# EAGLE design EmonTx_v2.2 (EAGLE 5.11)
ABBREV: tx1; DRAWING_AUTHOR: Glyn Husdson; PROJECT: EmonTx V1.0
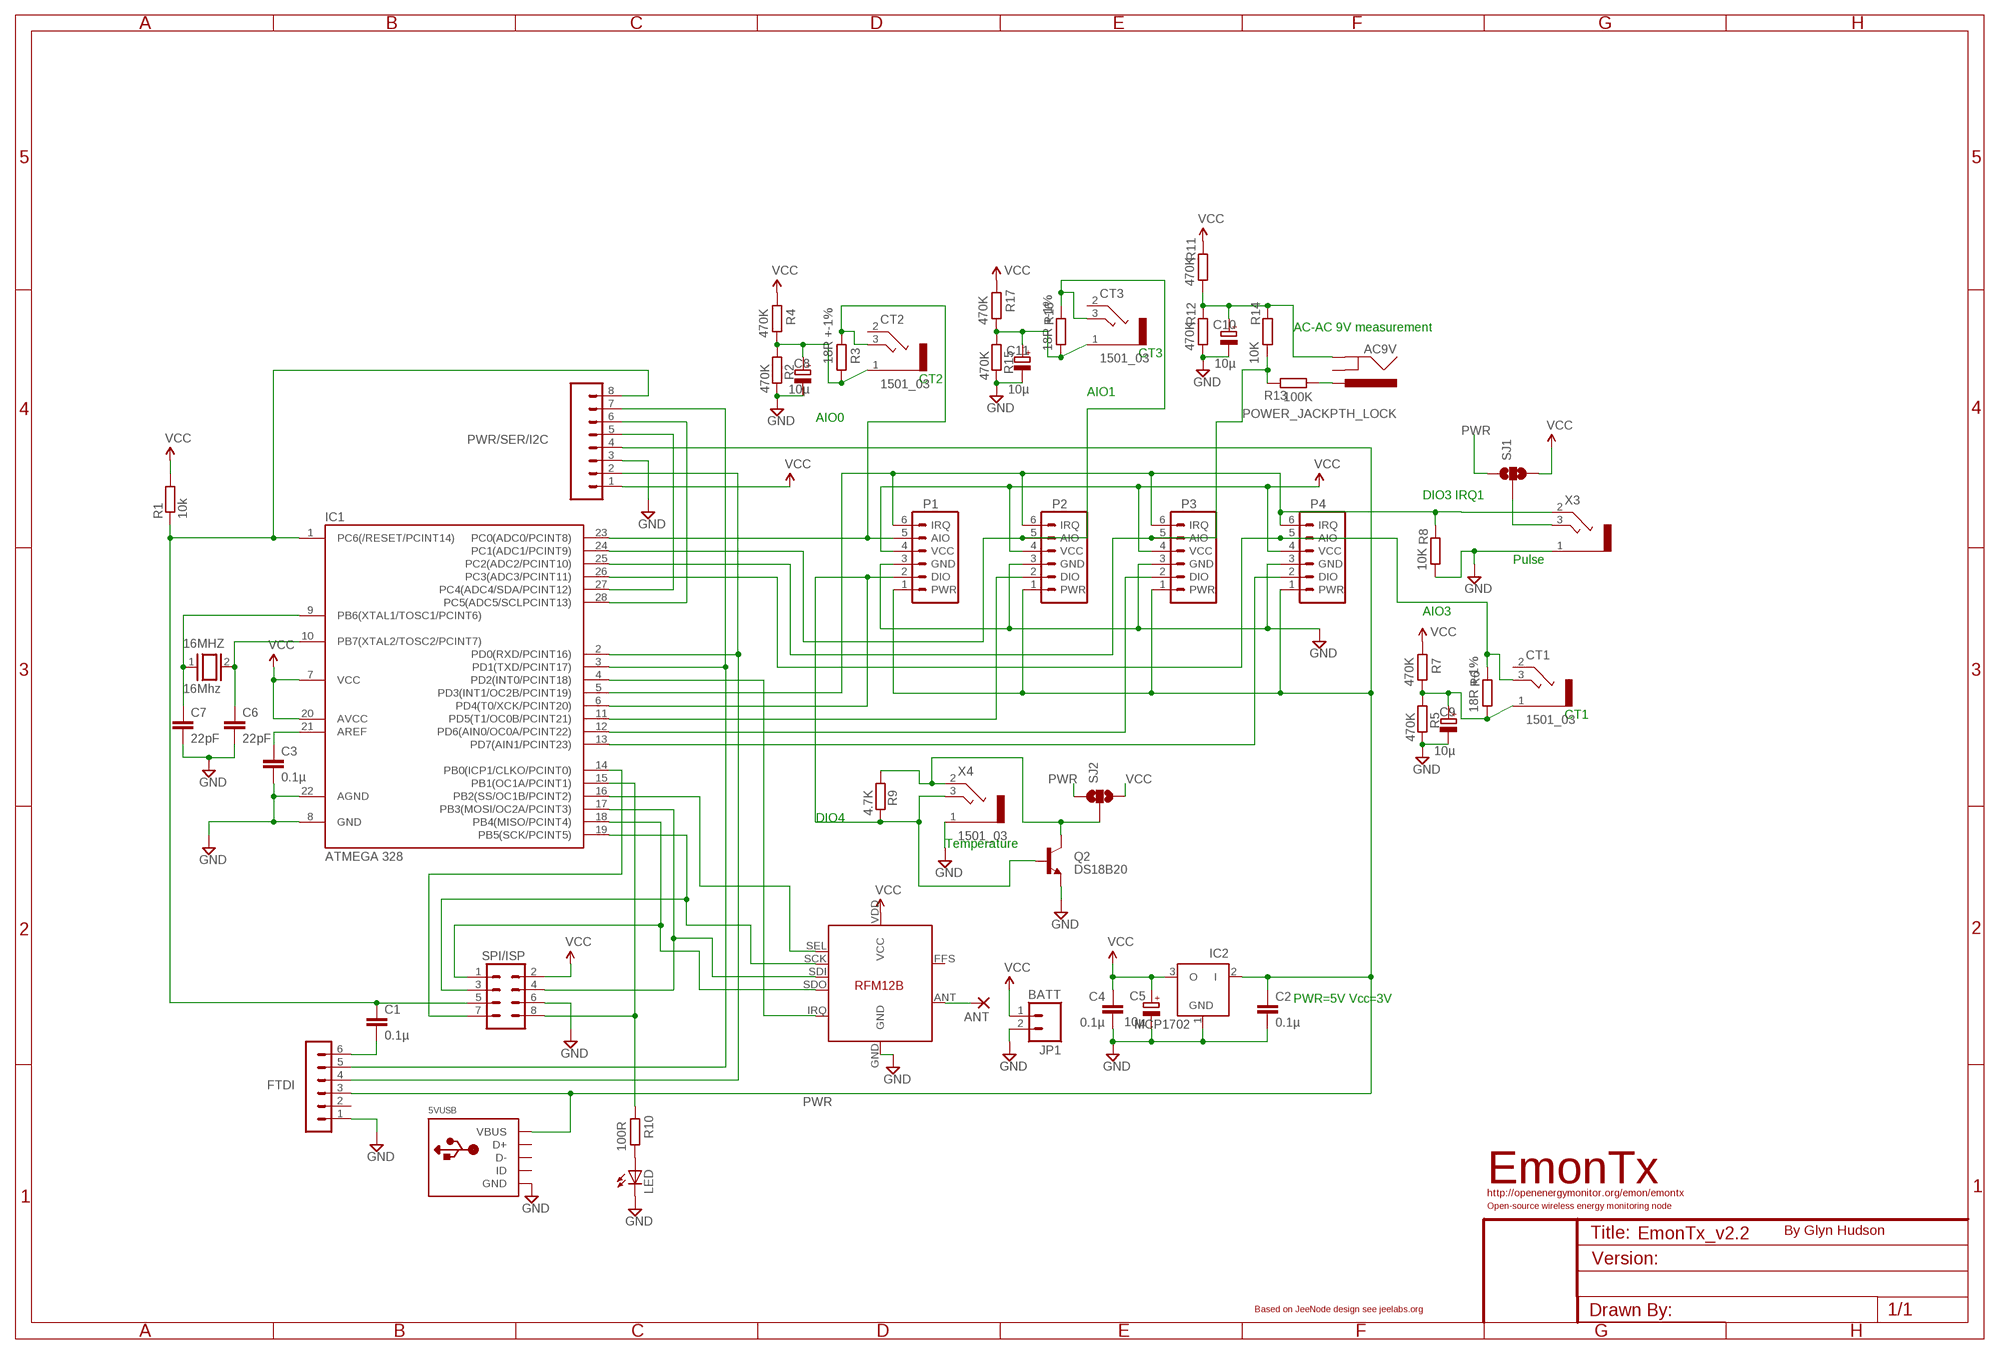
[diagram p0: schematic, sheet 1]

## Parts
5VUSB  USBMOLEX  [USB-MINIB-THM-MOLEX]
16MHZ  16Mhz  XTAL/S  [QS]
AC9V  POWER_JACKPTH_LOCK  [POWER_JACK_PTH_LOCK]
ANT  1,6/0,8  [1,6/0,8]
C1  0.1µ  C-EU025-024X044  [C025-024X044]
C2  0.1µ  C-EU025-024X044  [C025-024X044]
C3  0.1µ  C-EU025-024X044  [C025-024X044]
C4  0.1µ  C-EU025-024X044  [C025-024X044]
C5  10µ  CPOL-EUE1.8-4  [E1,8-4]
C6  22pF  C2.5/2  [C2.5-2]
C7  22pF  C2.5/2  [C2.5-2]
C8  10µ  CPOL-EUE1.8-4  [E1,8-4]
C9  10µ  CPOL-EUE1.8-4  [E1,8-4]
C10  10µ  CPOL-EUE1.8-4  [E1,8-4]
C11  10µ  CPOL-EUE1.8-4  [E1,8-4]
CT1  1501_03  [20-0144]
CT2  1501_03  [20-0144]
CT3  1501_03  [20-0144]
FTDI  FTDI  MA06-1  [MA06-1]
IC1  ATMEGA 328  ATMEGA48/88/168-PU  [DIL28-3]
IC2  MCP1702  MCP1702Z  [TO92]
JP1  BATT  M02LOCK_LONGPADS  [1X02_LOCK_LONGPADS]
LED  LED3MM  [LED3MM]
P1  JEEPORT  JEEPORT-LONGPADS  [PORT6PIN]
P2  JEEPORT  JEEPORT-LONGPADS  [PORT6PIN]
P3  JEEPORT  JEEPORT-LONGPADS  [PORT6PIN]
P4  JEEPORT  JEEPORT-LONGPADS  [PORT6PIN]
PWR/SER/I2C  M08  [1X08]
Q2  DS18B20  TRANSISTOR_NPNTO92  [TO-92]
R1  10k  R-EU_0204/7  [0204/7]
R2  470K  R-EU_0204/7  [0204/7]
R3  18R +-1%  R-EU_0204/7  [0204/7]
R4  470K  R-EU_0204/7  [0204/7]
R5  470K  R-EU_0204/7  [0204/7]
R6  18R +-1%  R-EU_0204/7  [0204/7]
R7  470K  R-EU_0204/7  [0204/7]
R8  10K  R-EU_0204/7  [0204/7]
R9  4.7K  R-EU_0204/7  [0204/7]
R10  100R  R-EU_0204/7  [0204/7]
R11  470K  R-EU_0204/7  [0204/7]
R12  470K  R-EU_0204/7  [0204/7]
R13  100K  R-EU_0204/7  [0204/7]
R14  10K  R-EU_0204/7  [0204/7]
R15  470K  R-EU_0204/7  [0204/7]
R16  18R +-1%  R-EU_0204/7  [0204/7]
R17  470K  R-EU_0204/7  [0204/7]
SJ1  SOLDERJUMPER_2WAY-OLDS  [SJ_3]
SJ2  SOLDERJUMPER_2WAY-OLDS  [SJ_3]
SV7  SPI/ISP  MA04-2  [MA04-2]
U$1  RFM12B  [RFM12B]
X3  1501_03  [20-0144]
X4  1501_03  [20-0144]

## Nets
A1: CT3.3 IC1.24(PC1(ADC1/PCINT9)) P2.5(AIO) R16.2
A2: IC1.25(PC2(ADC2/PCINT10)) P3.5(AIO) R13.2 R14.1
A3: CT1.3 IC1.26(PC3(ADC3/PCINT11)) P4.5(AIO) R6.2
GND [power]: 5VUSB.GND C2.2 C3.2 C4.2 C5.- C6.2 C7.2 C8.- C9.- C10.- C11.- FTDI.1 IC1.8(GND) IC1.22(AGND) IC2.1(GND) JP1.2 LED.K(C) P1.3(GND) P2.3(GND) P3.3(GND) P4.3(GND) PWR/SER/I2C.3 Q2.1(E) R2.2 R5.2 R8.1 R12.1 R15.2 SV7.6 U$1.GND X3.1 X4.1
INT2: IC1.5(PD3(INT1/OC2B/PCINT19)) P1.6(IRQ) P2.6(IRQ) P3.6(IRQ) P4.6(IRQ) R8.2 X3.2
N$1: 16MHZ.2 C6.1 IC1.10(PB7(XTAL2/TOSC2/PCINT7))
N$2: IC1.18(PB4(MISO/PCINT4)) SV7.1 U$1.SDO
N$3: IC1.17(PB3(MOSI/OC2A/PCINT3)) SV7.4 U$1.SDI
N$4: CT2.3 IC1.23(PC0(ADC0/PCINT8)) P1.5(AIO) R3.2
N$5: IC1.19(PB5(SCK/PCINT5)) SV7.3 U$1.SCK
N$6: IC1.15(PB1(OC1A/PCINT1)) R10.2 SV7.8
N$7: IC1.4(PD2(INT0/PCINT18)) U$1.IRQ
N$8: LED.A R10.1
N$9: IC1.11(PD5(T1/OC0B/PCINT21)) P2.2(DIO)
N$10: IC1.12(PD6(AIN0/OC0A/PCINT22)) P3.2(DIO)
N$11: IC1.13(PD7(AIN1/PCINT23)) P4.2(DIO)
N$12: 16MHZ.1 C7.1 IC1.9(PB6(XTAL1/TOSC1/PCINT6))
N$13: ANT.1(P) U$1.ANT
N$14: SJ1.2 X3.3
N$15: C1.2 FTDI.6
N$16: AC9V.GND C10.+ R11.1 R12.2 R14.2
N$17: C9.+ CT1.1 R5.1 R6.1 R7.1
N$18: IC1.16(PB2(SS/OC1B/PCINT2)) U$1.SEL
N$19: C3.1 IC1.21(AREF)
N$20: C8.+ CT2.1 R2.1 R3.1 R4.1
N$21: AC9V.PWR R13.1
N$22: IC1.14(PB0(ICP1/CLKO/PCINT0)) SV7.7
N$23: C11.+ CT3.1 R15.1 R16.1 R17.1
N$24: IC1.28(PC5(ADC5/SCLPCINT13)) PWR/SER/I2C.6
N$25: IC1.27(PC4(ADC4/SDA/PCINT12)) PWR/SER/I2C.5
N$26 [power]: IC1.6(PD4(T0/XCK/PCINT20)) P1.2(DIO) Q2.2(B) R9.2 X4.3
PWR [power]: 5VUSB.VBUS C2.1 FTDI.3 IC2.2(I) P1.1(PWR) P2.1(PWR) P3.1(PWR) P4.1(PWR) PWR/SER/I2C.4 Q2.3(C) R9.1 SJ1.1 SJ2.1 SJ2.2 X4.2
RST: C1.1 IC1.1(PC6(/RESET/PCINT14)) PWR/SER/I2C.8 R1.1 SV7.5
RXD: FTDI.4 IC1.2(PD0(RXD/PCINT16)) PWR/SER/I2C.2
TXD: FTDI.5 IC1.3(PD1(TXD/PCINT17)) PWR/SER/I2C.7
VCC [power]: C4.1 C5.+ IC1.7(VCC) IC1.20(AVCC) IC2.3(O) JP1.1 P1.4(VCC) P2.4(VCC) P3.4(VCC) P4.4(VCC) PWR/SER/I2C.1 R1.2 R4.2 R7.2 R11.2 R17.2 SJ1.3 SJ2.3 SV7.2 U$1.VDD(VCC)
Unconnected: 5VUSB.D+ 5VUSB.D- 5VUSB.ID AC9V.GNDBREAK CT1.2 CT2.2 CT3.2 FTDI.2 U$1.FFS

## Notes on the sheet
- AC-AC 9V measurement
- CT3
- CT2
- AIO1
- AIO0
- DIO3 IRQ1
- Pulse
- AIO3
- CT1
- DIO4
- Temperature
- PWR=5V Vcc=3V
- EmonTx
- http://openenergymonitor.org/emon/emontx
- Open-source wireless energy monitoring node
- By Glyn Hudson
- Based on JeeNode design see jeelabs.org

## Library data of the parts
5VUSB = adafruit:USB: USB Connectors USBMINIB - Surface Mount Female Mini-B USB Connector 4UConnector: 06564 By microbuilder.eu Thru-hole RA Female Mini-B USB Connector 4UConnector: 18732 By ladyada.net
16MHZ = special:XTAL/S: CRYSTAL
AC9V = SparkFun:POWER_JACK: Power Jack This is the standard 5.5mm barrel jack for power. The PTH is the most common, proven, reliable, footprint. All others are experimental. The Slot footprint only works if the mill layer is transmitted to the PCB fab house so be warned. Spark Fun Electronics SKU : PRT-00119. Mating wall wart : TOL-00298 (and others)
ANT = JeeLabs:1,6/0,8: THROUGH-HOLE PAD
C1-C4 = resistor:C-EU: CAPACITOR, European symbol
C5 C8-C11 = resistor:CPOL-EU: POLARIZED CAPACITOR, European symbol
C6 C7 = capacitor-wima:C: CAPACITOR naming: grid - package width
CT1-CT3 X3 X4 = rapid_3.5mm_jack:1501_03: Truconnect Minature PCB jack socket 3.5mm Rapid Part: 20-0144 Source: http://www.rapidonline.com/netalogue/specs/20-0144.pdff; OC_NEWARK: unknown; RAPID: 20-0144
FTDI = JeeLabs:MA06-1: PIN HEADER
IC1 = atmega8:ATMEGA48/88/168-PU
IC2 = JeeLabs:MCP1702: 200 mA, Low Power Low Dropout Voltage Regulator
JP1 = SparkFun:M02: Header 2 Standard 2-pin 0.1" header. Use with straight break away headers (SKU : PRT-00116), right angle break away headers (PRT-00553), swiss pins (PRT-00743), machine pins (PRT-00117), and female headers (PRT-00115). Molex polarized connector foot print use with SKU : PRT-08233 with associated crimp pins and housings.
LED = adafruit:LED: LED OSRAM: - CHIPLED LG R971, LG N971, LY N971, LG Q971, LY Q971, LO R971, LY R971 LH N974, LH R974 LS Q976, LO Q976, LY Q976 LO Q996 - Hyper CHIPLED LW Q18S LB Q993, LB Q99A, LB R99A - SideLED LS A670, LO A670, LY A670, LG A670, LP A670 LB A673, LV A673, LT A673, LW A673 LH A674 LY A675 LS A676, LA A676, LO A676, LY A676, LW A676 LS A679, LY A679, LG A679 - Hyper Micro SIDELED® LS Y876, LA Y876, LO Y876, LY Y876 LT Y87S - SmartLED LW L88C, LW L88S LB L89C, LB L89S, LG L890 LS L89K, LO L89K, LY L89K LS L896, LA L896, LO L896, LY L896 - TOPLED LS T670, LO T670, LY T670, LG T670, LP T670 LSG T670, LSP T670, LSY T670, LOP T670, LYG T670 LG T671, LOG T671, LSG T671 LB T673, LV T673, LT T673, LW T673 LH T674 LS T676, LA T676, LO T676, LY T676, LB T676, LH T676, LSB T676, LW T676 LB T67C, LV T67C, LT T67C, LS T67K, LO T67K, LY T67K, LW E67C LS E67B, LA E67B, LO E67B, LY E67B, LB E67C, LV E67C, LT E67C LW T67C LS T679, LY T679, LG T679 LS T770, LO T770, LY T770, LG T770, LP T770 LB T773, LV T773, LT T773, LW T773 LH T774 LS E675, LA E675, LY E675, LS T675 LS T776, LA T776, LO T776, LY T776, LB T776 LHGB T686 LT T68C, LB T68C - Hyper Mini TOPLED® LB M676 - Mini TOPLED Santana® LG M470 LS M47K, LO M47K, LY M47K Source: http://www.osram.convergy.de/
P1-P4 = JeeParts:JEEPORT: PIN HEADER
PWR/SER/I2C = SparkFun:M08: Header 8 Standard 8-pin 0.1" header. Use with straight break away headers (SKU : PRT-00116), right angle break away headers (PRT-00553), swiss pins (PRT-00743), machine pins (PRT-00117), and female headers (PRT-00115).
Q2 = SparkFun:TRANSISTOR_NPN: Transistor NPN BJT configuration in SOT23 package. MMBT2222 is the common NPN we use. Double check BCE configuration again layout.
R1 = resistor:R-EU_: RESISTOR, European symbol
R2-R17 = rcl:R-EU_: RESISTOR, European symbol
SJ1 SJ2 = SparkFun:SOLDERJUMPER_2WAY-OLD: Solder Jumper 2 way solder jumper
SV7 = JeeLabs:MA04-2: PIN HEADER
U$1 = JeeLabs:RFM12B

## Net classes
0 default: width 0.203 mm, drill 0.6 mm, clearance 0.203 mm
1 power: width 0.381 mm, drill 0.6 mm, clearance 0.254 mm

## Board
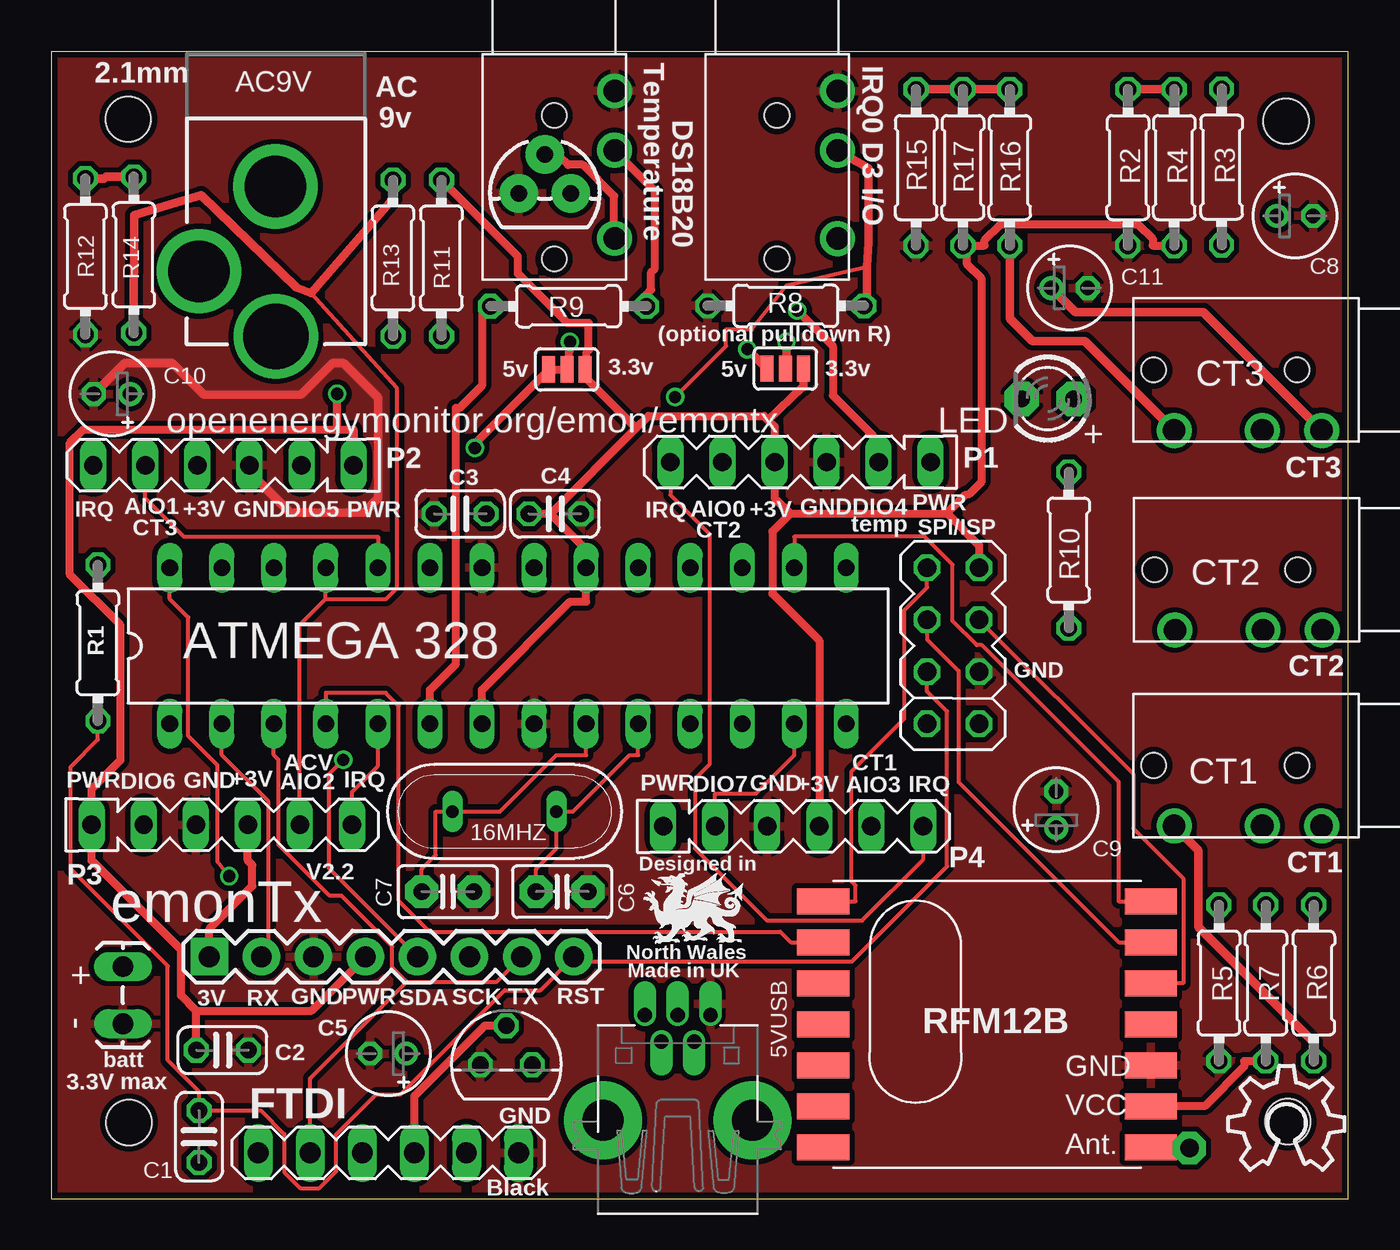
[diagram p1: board, top side]
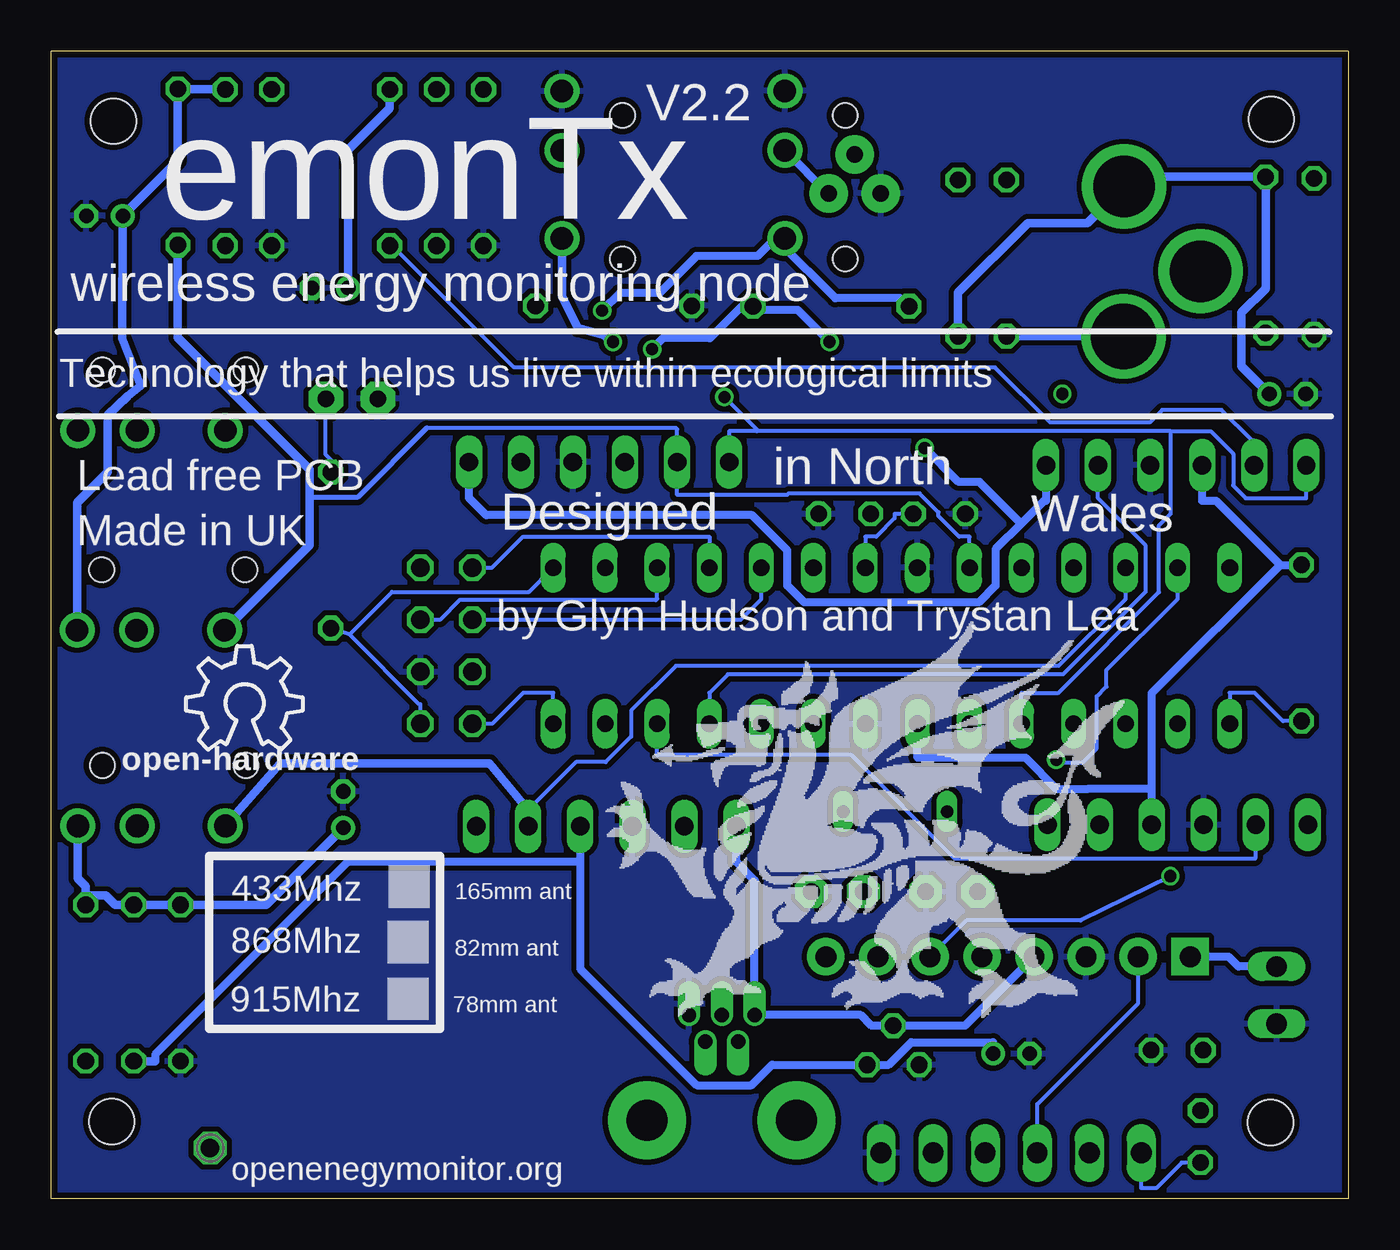
[diagram p2: board, bottom side, seen from below]

Size 63.3 x 56 mm. Coordinates in mm from the lower left corner, seen from the top.
Outline: 0,56 63.3,56 63.3,0 0,0 0,56
Copper layers (1*16): Top 0.035mm / dielectric 1.5mm / Bottom 0.035mm
Design rules "PCB-POOL Standard *": minimum track width 0.2mm, minimum drill 0.6mm, track to track 0.2mm, track to pad 0.2mm, pad to pad 0.2mm, via to via 0.2mm, smd to smd 0.2mm, copper to edge 0.3mm, drill to drill 0.2mm, minimum pad ring 0.2mm, minimum via ring 0.15mm, stop-mask expansion 0.075mm, vias tented up to drill 0.6mm, thermal gap 0.2mm
Holes 2.2 mm at 3.76,52.69 60.26,52.59 60.34,3.76 3.79,3.71

### Footprints (pad centres in the part's own frame; a part is rotated, then mirrored left to right if it is on the bottom)
USB-MINIB-THM-MOLEX = drill 0.7 offset: D+ 0,9.72; D- -0.8,8.42; GND 1.6,9.72; ID 0.8,8.42; VBUS -1.6,9.72 | drill 2 pad 3.81 round: GND1 -3.65,4.57; GND4 3.65,4.57
QS = drill 0.61 long: 1 -2.54,0; 2 2.54,0
POWER_JACK_PTH_LOCK = drill 2.997 pad 4.115 round: GND 0.025,6.557; GNDBREAK 3.762,10.7 | drill 3.2 pad 4.115 round: PWR 0,13.878
1,6/0,8 = drill 0.9 pad 1.6 octagon: 1 0,0
C025-024X044 = drill 0.813 octagon: 1 -1.27,0; 2 1.27,0
E1,8-4 = drill 0.711 pad 1.168 round: + -0.889,0 | drill 0.711 pad 1.168 octagon: - 0.889,0
C2.5-2 = drill 0.813 pad 1.6 octagon: 1 -1.27,0; 2 1.27,0
20-0144 = drill 1.1 pad 1.7 round: 1 3.45,0.2; 2 3.45,-2.7; 3 3.45,-7 | hole 1.2: 0.5,-1; 0.5,-8
MA06-1 = drill 1.016 long: 1 0,0; 2 2.54,0; 3 5.08,0; 4 7.62,0; 5 10.16,0; 6 12.7,0
DIL28-3 = drill 0.813 long: 1 -16.51,-3.81; 2 -13.97,-3.81; 3 -11.43,-3.81; 4 -8.89,-3.81; 5 -6.35,-3.81; 6 -3.81,-3.81; 7 -1.27,-3.81; 8 1.27,-3.81; 9 3.81,-3.81; 10 6.35,-3.81; 11 8.89,-3.81; 12 11.43,-3.81; 13 13.97,-3.81; 14 16.51,-3.81; 15 16.51,3.81; 16 13.97,3.81; 17 11.43,3.81; 18 8.89,3.81; 19 6.35,3.81; 20 3.81,3.81; 21 1.27,3.81; 22 -1.27,3.81; 23 -3.81,3.81; 24 -6.35,3.81; 25 -8.89,3.81; 26 -11.43,3.81; 27 -13.97,3.81; 28 -16.51,3.81
TO92 = drill 0.813 octagon: 1 -1.27,0; 2 0,1.905; 3 1.27,0
1X02_LOCK_LONGPADS = drill 1.016 long: 1 -0.127,0; 2 2.667,0
LED3MM = drill 0.813 pad 1.676 octagon: A -1.27,0; K 1.27,0
PORT6PIN = drill 0.9 long: 1 -6.35,0; 2 -3.81,0; 3 -1.27,0; 4 1.27,0; 5 3.81,0; 6 6.35,0
1X08 = drill 1.016 pad 1.829 square: 1 0,0 | drill 1.016 pad 1.829 round: 2 2.54,0; 3 5.08,0; 4 7.62,0; 5 10.16,0; 6 12.7,0; 7 15.24,0; 8 17.78,0
TO-92 = drill 0.813 pad 1.88 round: 1 -1.27,0; 2 0,1.905; 3 1.27,0
0204/7 = drill 0.813 octagon: 1 -3.81,0; 2 3.81,0
SJ_3 = smd 0.635 x 1.27: 1 -0.889,0; 2 0,0; 3 0.889,0
MA04-2 = drill 0.9 octagon: 1 -3.81,-1.27; 2 -3.81,1.27; 3 -1.27,-1.27; 4 -1.27,1.27; 5 1.27,-1.27; 6 1.27,1.27; 7 3.81,-1.27; 8 3.81,1.27
RFM12B = smd 2.54 x 1.27: ANT 8,-6; FFS -8,2; GND 8,-2; IRQ -8,4; P$8 -8,0; P$9 -8,-2; P$10 -8,-4; P$12 -8,-6; P$16 8,0; SCK 8,4; SDI 8,2; SDO -8,6; SEL 8,6; VDD 8,-4

### Placement (x,y rotation side)
5VUSB  30.57,-0.75 0 top
16MHZ  22.12,18.9 0 top
AC9V  10.97,55.96 180 top
ANT  55.54,2.47 0 bottom
C1  7.21,3.03 270 top
C2  8.35,7.25 0 top
C3  19.96,33.42 180 top
C4  24.58,33.42 0 top
C5  16.44,7.08 180 top
C6  24.93,14.99 0 top
C7  19.35,14.98 0 top
C8  60.7,47.96 0 top
C9  49.05,18.99 90 top
C10  2.96,39.28 180 top
C11  49.7,44.45 0 top
CT1  61.8,21.64 270 top
CT2  61.84,31.2 270 top
CT3  61.8,40.94 270 top
FTDI  22.8,2.24 180 top
IC1  22.29,26.98 0 top
IC2  22.21,6.53 0 top
JP1  3.5,11.2 270 top
LED  48.63,39.04 180 top
P1  36.57,35.95 180 top
P2  8.4,35.8 180 top
P3  8.32,18.24 0 top
P4  36.21,18.17 0 top
PWR/SER/I2C  7.72,11.8 0 top
Q2  24.09,49.07 0 top
R1  2.28,27.12 90 top
R2  52.55,50.32 270 top
R3  57.12,50.35 270 top
R4  54.81,50.32 270 top
R5  56.99,10.52 270 top
R6  61.61,10.52 270 top
R7  59.28,10.52 270 top
R8  35.85,43.57 0 top
R9  25.25,43.55 180 top
R10  49.66,31.65 270 top
R11  19.04,45.91 90 top
R12  1.67,45.98 90 top
R13  16.68,45.91 90 top
R14  4.03,46.06 90 top
R15  42.21,50.32 270 top
R16  46.78,50.32 270 top
R17  44.49,50.32 270 top
SJ1  35.83,40.52 0 top
SJ2  25.16,40.47 0 top
SV7  44.01,26.98 270 top
U$1  45.67,8.51 0 top
U$2  Open-source Hardware  [OSHW_8X200_NOTEXT]  56.7,21.9 0 bottom
U$3  Open-source Hardware  [OSHW_8X200_NOTEXT]  57.45,1.4 0 top
X3  34.92,53.86 0 top
X4  24.05,53.86 0 top

### Tracks (layer width: path | path; a pad name or v marks a point on that pad's centre or on a via)
A1
  Top 0.203: IC1.24 15.94,32.31 6.47,32.31 4.59,34.19 P2.5
  Top 0.406: R16.2 46.78,42.95 47.88,41.85 50.44,41.85 CT3.3
  Bottom 0.203: P2.5 4.59,36.99 4.69,36.99 6.19,38.49 9.09,38.49 9.7,37.88 14.55,37.88 17.24,40.57 40.71,40.57 46.65,46.51 R16.2
A2
  Top 0.203: 12.69,44.2 16.88,39.56 16.88,29.81 16.35,29.27 13.4,29.27 | 13.4,29.27 IC1.25 | P3.5 12.13,28 13.4,29.27
  Top 0.406: R14.1 4.05,48 7.33,48.98 11.98,44.45 12.69,44.2 16.68,48.8 R13.2
A3
  Top 0.203: CT1.3 54.81,18.17
  Top 0.406: R6.2 61.61,7.62 55.97,13.26 55.97,17 54.81,18.17
  Bottom 0.203: IC1.26 10.86,29.27 14.14,26 32.82,26 34.99,23.82 34.99,22.55 36.24,21.3 37.69,21.3 40.02,18.97
  Bottom 0.406: CT1.3 52.13,21.25 41.92,21.25 40.02,18.97 P4.5
GND
  Top 0.406: P2.3 9.67,35.48 11.66,33.49 15.26,33.49 15.95,34.18 15.95,39.09 14.27,40.78 13.73,40.78 12.19,39.25 7.44,39.25 5.9,40.78 3.58,40.78 C10.-
  pour Bottom (isolate 0.254): 65.61,58.79 65.75,-1.8 -1.62,-1.8 -1.48,58.79
  pour Top: -1.87,59.49 67.21,59.49 67.21,-2.56 -1.95,-2.56 -1.95,59.56
INT2  (via drill 0.6)
  Top 0.203: 39.81,43.72 R8.2 | P4.6 42.56,16.56 39.57,13.57 34.94,13.57 31.41,17.1 31.41,20.47 32.12,21.19 32.12,32.44 30.22,34.34 P1.6 | P3.6 14.67,19.85 15.94,21.12 IC1.5 | v30.45,39.12 32.94,41.61 32.94,42.43 34.21,42.43 35.9,44.58 39.8,45.49
  Top 0.406: X3.2 39.88,50.28 39.88,46.65 39.8,45.49 39.81,43.72
  Bottom 0.203: 8.66,37.45 28.87,37.45 | 28.87,37.45 30.22,37.45 P1.6 | 8.66,37.45 6.71,37.45 5.62,36.36 5.62,34.81 5.01,34.19 2.05,34.19 P2.6 | 8.66,37.45 8.66,33.43 9.24,32.86 9.24,29.6 14.15,24.69 15.94,24.69 IC1.5 | v30.45,39.12 28.87,37.55 28.87,37.45
N$1
  Top 0.203: IC1.10 28.64,21.65 28.22,21.65 25.47,18.9 16MHZ.2 24.66,17.08 23.66,16.09 C6.1
N$2
  Top 0.203: SV7.1 42.74,29.84 41.63,28.73 41.63,23.43 39.06,20.86 39.06,15.47 39.25,15.29 39.25,14.51 U$1.SDO
  Bottom 0.203: IC1.18 31.18,32.31 40.27,32.31 41.79,30.79 SV7.1
N$3
  Top 0.203: U$1.SDI 55.25,10.51 55.25,15.64 52.81,18.08 52.81,20.72 SV7.4
  Bottom 0.203: IC1.17 33.72,29.27 33.79,29.21 43.37,29.21 44.33,28.25 SV7.4
N$4
  Bottom 0.203: 44.97,37.62 32.82,37.62 32.76,37.55 P1.5 32.76,34.34 27.38,34.34 27.31,34.42 20.93,34.42 19.99,33.49 19.99,33.31 18.99,32.31 18.48,32.31 IC1.23
  Bottom 0.254: 50.68,34.23 48.36,34.23 44.97,37.62
  Bottom 0.406: R3.2 57.12,42.02 50.68,35.58 50.68,34.23 50.68,31.91 CT2.3
N$5
  Top 0.203: SV7.3 42.74,27.3 44.27,25.76 44.27,20.34 52.1,12.51 U$1.SCK
  Bottom 0.203: IC1.19 28.64,29.27 29.67,28.25 SV7.3
N$6
  Bottom 0.203: SV7.8 45.28,24.13 45.34,24.13 48.75,27.54 | 48.75,27.54 R10.2 | 48.75,27.54 46.67,29.61 39.98,29.61 IC1.15
N$7
  Top 0.203: IC1.4 13.4,24.69 16.33,24.69 16.96,24.06 16.96,14.53 18.47,13.02 35.59,13.02 36.1,12.51 U$1.IRQ
N$8
  Bottom 0.203: R10.1 49.66,36.07 49.9,36.31 LED.A
N$9
  Bottom 0.203: IC1.11 31.18,24.69 30.28,25.59 13.92,25.59 9.89,29.63 9.89,31.87 12.21,34.19 P2.2
N$10
  Bottom 0.203: IC1.12 33.72,21.65 24.26,21.65 19.19,16.59 4.56,16.59 4.51,16.64 P3.2
N$11
  Top 0.203: P4.2 32.4,19.77 34.38,19.77 36.26,21.65 IC1.13
N$12
  Top 0.203: C7.1 18.08,16.09 18.77,16.77 18.77,18.9 16MHZ.1 21.9,18.9 24.66,21.65 26.1,21.65 IC1.9
N$13
  Top 0.203: U$1.ANT 54.4,2.51 54.44,2.47
  Top 0.61: ANT.1 54.44,2.47
N$14  (via drill 0.6)
  Top 0.203: 35.88,40.72 SJ1.2
  Top 0.406: 35.88,40.72 v35.88,41.82
  Bottom 0.406: v35.88,41.82 36.39,42.17 37.59,42.48 38.37,44.02 X3.3
N$15
  Bottom 0.203: FTDI.6 10.1,0.51 9.37,0.51 8.13,1.76 C1.2
N$16
  Top 0.203: 2.66,49.87 2.58,49.79
  Top 0.406: 2.58,49.79 R12.2 | R14.2 2.66,49.87
  Bottom 0.406: R11.1 19.04,44.21 15.65,47.61 12.74,47.61 AC9V.GND 10.48,49.87 R14.2 4.03,44.42 5.21,43.24 5.21,40.63 C10.+
N$17
  Bottom 0.203: 61.61,14.79 R6.1
  Bottom 0.406: CT1.1 62,15.64 61.61,15.24 61.61,14.79 60.64,14.79 60.19,14.33 R7.1 R5.1 52.81,14.33 C9.+
N$18
  Top 0.203: IC1.16 36.26,32.31 42.62,32.31 43.99,30.94 43.99,28.19 45.16,27.02 45.43,27.02 52.1,20.35 52.1,14.51 U$1.SEL
N$19
  Bottom 0.203: C3.1 22.14,33.42 22.14,33.21 23.04,32.31 23.56,32.31 IC1.21
N$20
  Top 0.406: R4.1 R2.1
  Bottom 0.203: 57.12,54.13 R3.1
  Bottom 0.406: CT2.1 62.04,33.97 60.55,35.45 60.55,38.23 59.56,39.16 58.93,39.68 59.83,41.98 C8.+ 57.12,50.65 57.12,54.13 R4.1
N$21
  Bottom 0.203: AC9V.PWR 10.97,42.09
  Bottom 0.406: 10.97,42.09 R13.1
N$22
  Bottom 0.203: SV7.7 41.79,23.17 40.27,24.69 38.8,24.69 IC1.14
N$23
  Top 0.406: CT3.1 56.23,43.27 49.99,43.27 C11.+ | R16.1 R17.1 R15.1
  Bottom 0.406: C11.+ 48.81,51.19 46.78,53.22 R16.1
N$24  (via drill 0.6 pad 0.9)
  Top 0.203: IC1.28 5.78,29.27 6.69,28.36 6.69,22.57 8.12,21.15 8.12,16.45 v8.68,15.73
  Bottom 0.203: PWR/SER/I2C.6 18.64,13.58 13.07,13.58 v8.68,15.73
N$25  (via drill 0.6 pad 0.9)
  Top 0.203: PWR/SER/I2C.5 13.56,16.12 13.56,20.72 v14.25,21.41
  Bottom 0.203: IC1.27 8.32,29.27 11.8,25.8 11.8,24.99 12.27,24.51 12.27,21.98 12.96,21.29 14.12,21.29 v14.25,21.41
N$26  (via drill 0.6)
  Top 0.381: IC1.6 18.48,24.83 19.75,26.1 19.75,38.59 19.93,38.59 21.05,39.71 21.05,43.16 R9.2 | P1.2 40.1,36.23 40.1,37.24 38.14,39.2 38.14,41.61 v36.42,43.34 | Q2.2 24.1,50.96 24.83,50.96 24.83,50.83 25.21,50.45 25.95,50.45 27.48,48.93 27.48,46.87 X4.3
  Bottom 0.381: v36.42,43.34 35.55,44.2 33.62,44.2 31.82,46.01 28.82,46.01 27.98,46.84 27.5,46.84 X4.3 27.75,46.67 25.04,43.95 21.84,43.95 21.46,43.57 R9.2
PWR  (via drill 0.6)
  Top 0.381: P2.1 14.75,37.54 13.96,37.54 | 13.96,37.54 1.57,37.54 0.91,36.89 0.91,30.46 3.38,27.99 3.38,21.4 1.97,19.99 P3.1 1.97,16.5 6.34,12.14 6.34,9.92 7.08,9.17 | PWR/SER/I2C.4 12.7,9.17 7.08,9.17 | C2.1 7.08,9.17 | IC2.2 21.16,8.44 17.72,5 FTDI.3 | v13.95,39.27 13.96,38.21 13.96,37.54 | v33.98,41.46 34.92,40.52 SJ1.1 | v25.32,41.82 25.32,41.38 25.27,41.33 25.27,40.67 25.24,40.65 SJ2.2 25.14,40.47 SJ2.1 24.15,40.32 20.67,36.84 v20.67,36.63 | X4.2 27.5,51.14 29.46,49.18 29.46,45.4 29.28,45.22 29.28,44.36 29.05,44.13 29.05,43.57 R9.1
  Bottom 0.381: P1.1 42.92,34.2 42.08,33.36 29.1,33.36 27.37,31.64 27.37,29.92 26.55,29.1 18.04,29.1 17.21,29.92 17.21,31.7 15.96,32.95 | P2.1 14.75,34.05 14.86,34.05 15.96,32.95 | PWR/SER/I2C.4 18.7,8.44 IC2.2 23.26,8.44 23.79,8.97 5VUSB.VBUS 28.97,15.53 29.86,16.42 P4.1 | X4.2 27.48,51.14 25.42,49.08 25.37,49.08 Q2.3 | v33.98,41.46 33.44,41.99 31.16,41.99 29.61,43.54 29.08,43.54 R9.1 29,43.36 26.87,43.36 v25.32,41.82 | v20.67,36.63 19.02,34.98 18,34.98 16.1,33.08 15.96,32.95
RST
  Top 0.203: R1.1 2.28,22.4 0.94,21.06 0.94,16.1 5.68,11.36 5.68,6.74 7.21,5.21 C1.1 10.22,4.3 11.37,3.15 11.37,1.29 12.15,0.51 13.08,0.51 13.91,1.34 13.91,3.15 15.86,5.1 17.05,5.1 22.13,10.18 23.87,10.18 PWR/SER/I2C.8 25.73,11.57 39.07,11.57 43.72,16.22 43.72,23.78 42.74,24.76 SV7.5
  Bottom 0.203: R1.1 3.19,23.31 4.57,24.69 5.78,24.69 IC1.1
RXD
  Top 0.203: IC1.2 8.32,21.65 10.6,19.38 10.6,12.15 PWR/SER/I2C.2
  Bottom 0.203: PWR/SER/I2C.2 10.25,9.54 15.18,4.61 FTDI.4
TXD
  Top 0.203: 17.35,10.58 16.64,11.3 16.64,12.3 14.17,14.78 13.59,14.78 11.1,17.27 11.1,21.42 10.86,21.65 IC1.3 | PWR/SER/I2C.7 21.74,10.58 17.35,10.58 | 17.35,10.58 12.64,5.87 FTDI.5
VCC
  Top 0.381: R4.2 53.75,46.51 53.75,46.84 53.02,47.57 46.34,47.57 45.54,46.78 45.54,46.51 R17.2 44.7,46.34 44.7,45.6 45.41,44.89 45.41,35.01 44.8,34.4 44.62,34.36 43.71,33.45 | 36.07,33.44 35.3,34.2 P1.4 35.3,37.69 34.99,38 | 36.07,33.44 35.19,32.56 35.19,29.53 37.48,27.24 P4.4 | 36.07,33.44 43.69,33.44 43.71,33.45 | 43.71,33.45 45.28,31.89 SV7.2 | 24.36,33.42 28.54,37.6 | 28.54,37.6 29.14,38.2 34.79,38.2 34.99,38 | 24.36,33.42 26.1,31.68 IC1.20 26.1,29.13 25.33,29.13 21.02,24.83 IC1.7 | 24.36,33.42 C4.1 | R7.2 58.23,6.71 58.23,6.45 56.29,4.51 U$1.VDD | P3.4 9.59,16.5 9.81,16.29 9.81,15.26 7.71,13.16 PWR/SER/I2C.1 | 28.54,37.6 28.42,37.73 26.15,39.99 26.15,40.37 SJ2.3 26.13,40.65 26.13,41.31 26.23,41.41 26.23,42.73 25.19,42.73 22.78,45.14 22.78,45.98 R11.2 | 36.59,40.32 36.7,40.49 SJ1.3 | 34.99,38 36.67,39.61
  Top 0.406: 36.67,39.61 36.72,39.61 SJ1.3
  Bottom 0.381: 3.33,30.93 9.59,24.67 9.59,19.99 | 3.33,30.93 6.45,34.05 7.13,34.05 P2.4 | P3.4 9.59,19.99 | IC1.7 21.02,21.51 15.75,21.51 14.21,19.98 12.75,19.98 12.75,19.99 9.59,19.99 | 37.48,16.42 37.48,11.22 31.8,5.53 29.12,5.53 28.12,6.53 IC2.3 22.43,6.53 21.33,7.63 17.33,7.63 C5.+ | 37.48,16.42 48.84,16.42 58.23,7.04 58.23,6.71 | P4.4 37.48,16.42 | PWR/SER/I2C.1 5.84,11.8 5.36,11.33 JP1.1 | 3.33,30.93 R1.2
  Bottom 0.406: 58.23,6.71 R7.2

### Text on the board
_tsilk: Temperature | IRQ0 D3 I/O | 2.1mm | AC | DS18B20 | 9v | (optional pulldown R) | 5v | 3.3v | 5v | 3.3v | openenergymonitor.org/emon/emontx | C3 | P1 | C4 | CT3 | PWR | IRQ | AIO1 | +3V | GND | DIO5 | PWR | IRQ | AIO0 | +3V | GND | temp | DIO4 | CT3 | CT2 | SPI/ISP | R1 | GND | CT2 | ACV | CT1 | PWR | DIO6 | GND | +3V | AIO2 | IRQ | PWR | DIO7 | GND | +3V | AIO3 | IRQ | V2.2 | Designed in | P4 | CT1 | P3 | emonTx | + | North Wales | Made in UK | 3V | RX | GND | PWR | C5 | SDA | SCK | TX | RST | RFM12B | - | batt | C2 | max | 3.3V | FTDI | GND | Black
_bsilk: V2.2 | emonTx | wireless energy monitoring node | Technology that helps us live within ecological limits | in North | Lead free PCB | Wales | Designed | Made in UK | by Glyn Hudson and Trystan Lea | open-hardware | 165mm ant | 433Mhz | 82mm ant | 868Mhz | 78mm ant | 915Mhz | openenegymonitor.org